# Altium schematic sheet LIDO-HW.300.DisplayInterface.SchDoc
size A3; SheetNumber: 15; SheetTotal: 17
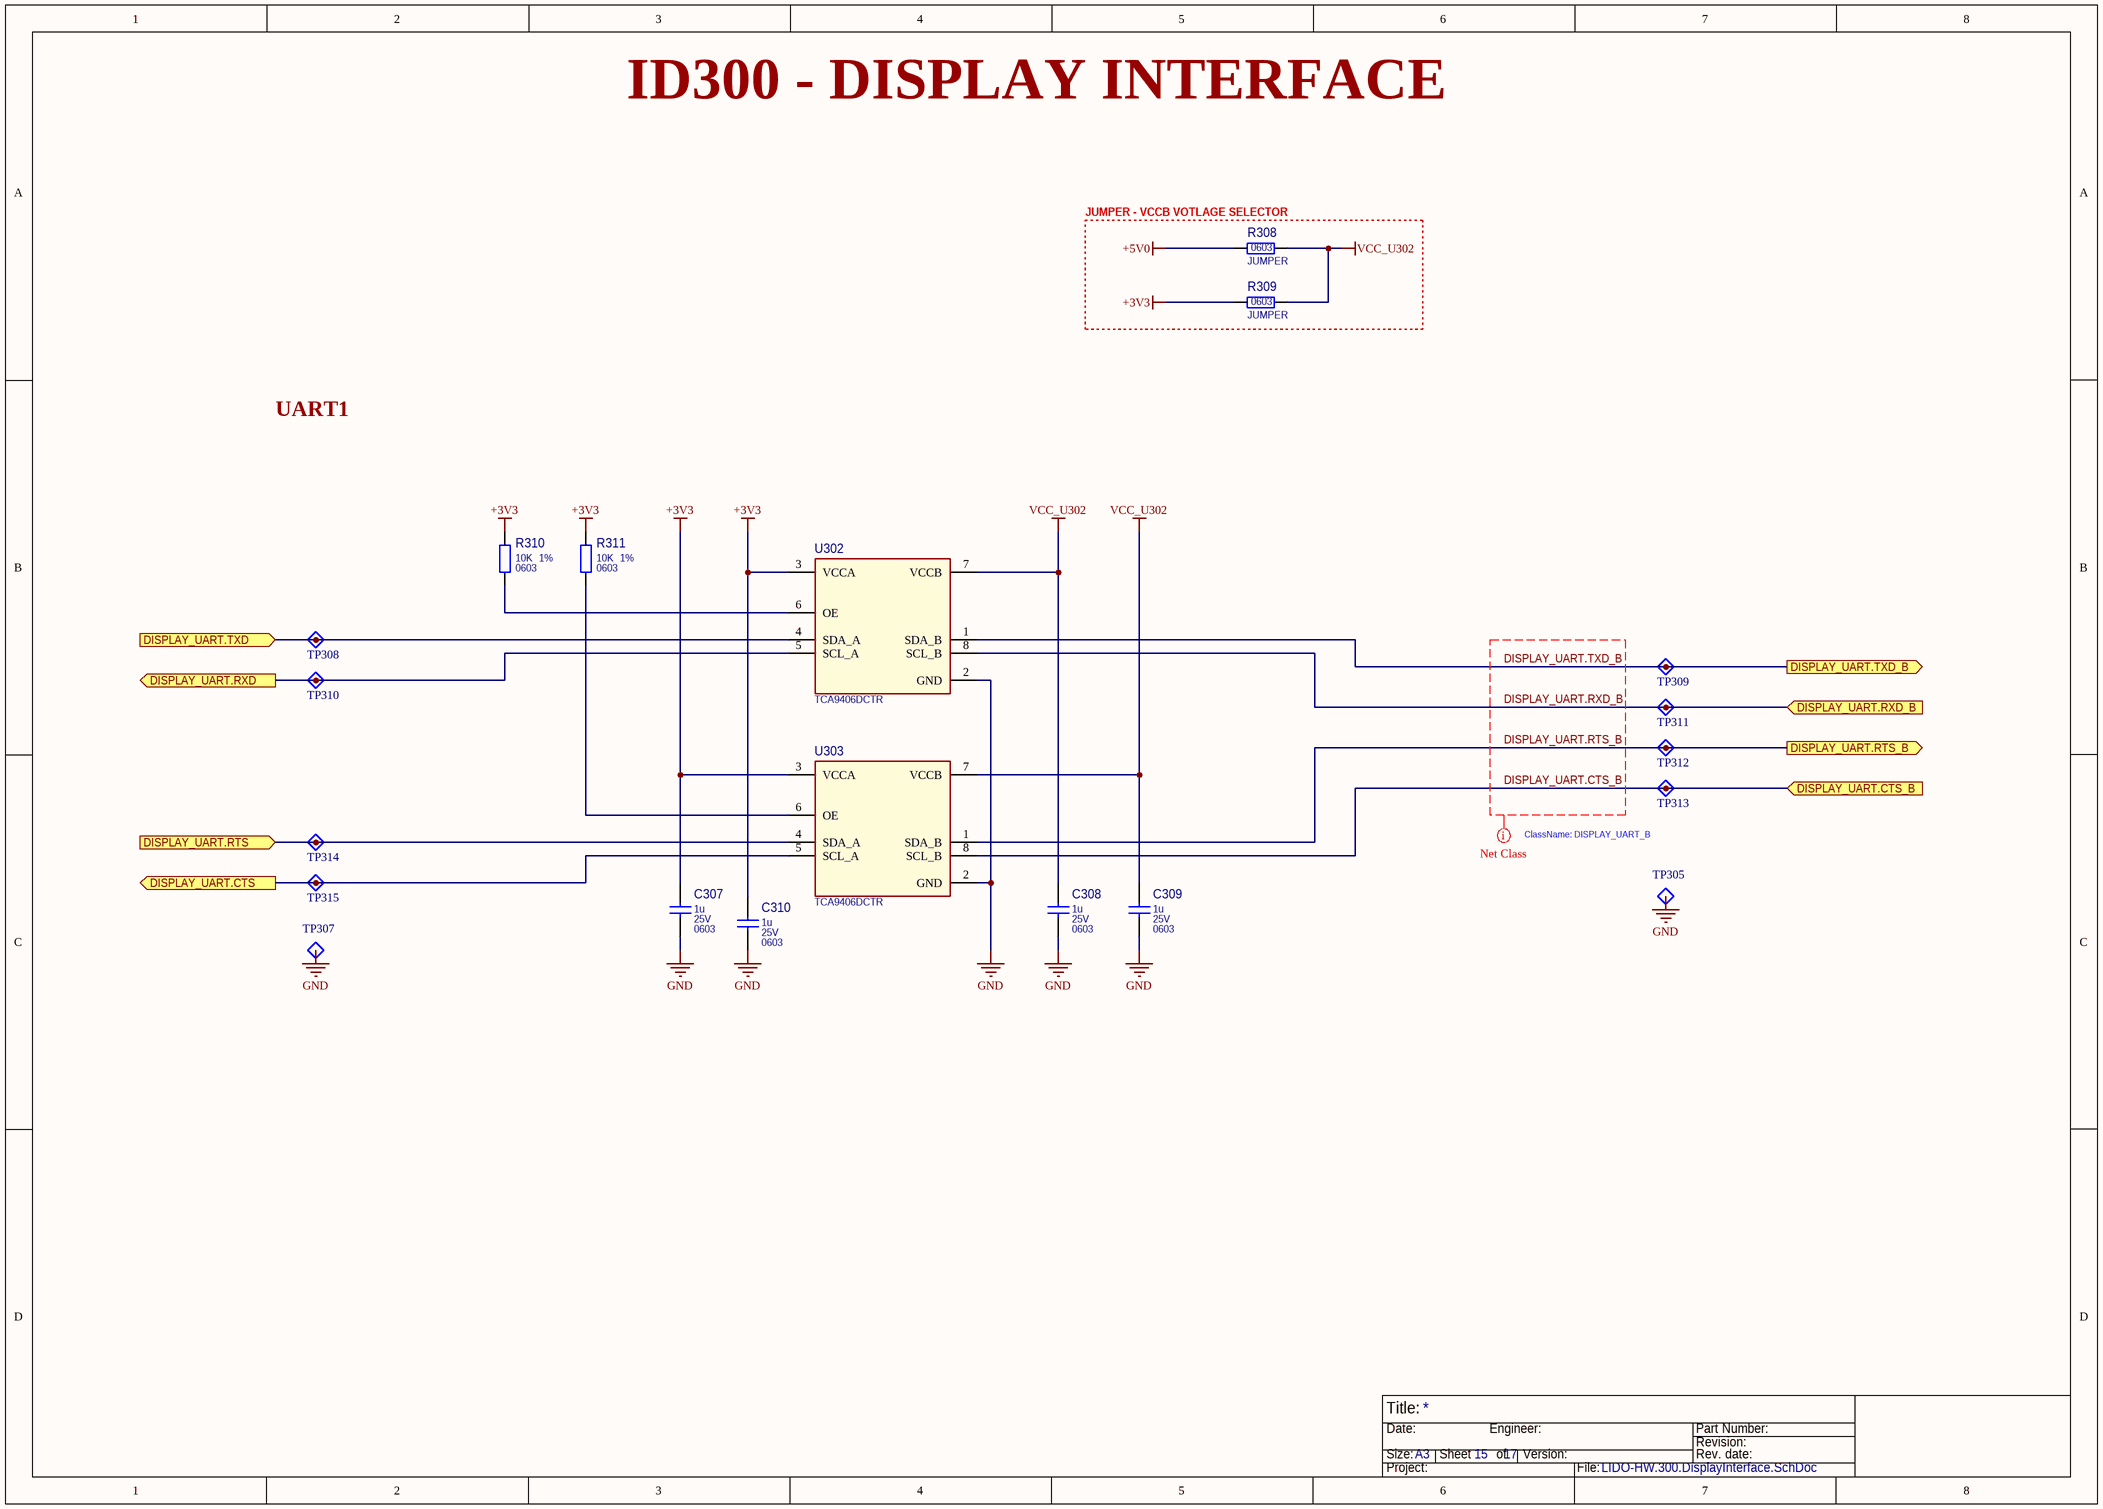
[diagram p0: LIDO-HW.300.DisplayInterface.SchDoc]

## Parts
C307  1u  Part Value 2: 25V  Part Package: 0603  [CAP_0603_1608X90-N_MURATA_A]
C308  1u  Part Value 2: 25V  Part Package: 0603  [CAP_0603_1608X90-N_MURATA_A]
C309  1u  Part Value 2: 25V  Part Package: 0603  [CAP_0603_1608X90-N_MURATA_A]
C310  1u  Part Value 2: 25V  Part Package: 0603  [CAP_0603_1608X90-N_MURATA_A]
R308  JUMPER  Part Package: 0603  [RES_0603_1608X60-N_YAGEO_A]
R309  JUMPER  Part Package: 0603  [RES_0603_1608X60-N_YAGEO_A]
R310  10K  Part Value 2: 1%  Part Package: 0603  [RES_0603_1608X60-N_YAGEO_A]
R311  10K  Part Value 2: 1%  Part Package: 0603  [RES_0603_1608X60-N_YAGEO_A]
TP305  TestPoint_A  [TESTPOINT_1D_A]  (value not drawn)  (no BOM)
TP307  TestPoint_A  [TESTPOINT_1D_A]  (value not drawn)  (no BOM)
TP308  TestPoint_A  [TESTPOINT_1D_A]  (value not drawn)  (no BOM)
TP309  TestPoint_A  [TESTPOINT_1D_A]  (value not drawn)  (no BOM)
TP310  TestPoint_A  [TESTPOINT_1D_A]  (value not drawn)  (no BOM)
TP311  TestPoint_A  [TESTPOINT_1D_A]  (value not drawn)  (no BOM)
TP312  TestPoint_A  [TESTPOINT_1D_A]  (value not drawn)  (no BOM)
TP313  TestPoint_A  [TESTPOINT_1D_A]  (value not drawn)  (no BOM)
TP314  TestPoint_A  [TESTPOINT_1D_A]  (value not drawn)  (no BOM)
TP315  TestPoint_A  [TESTPOINT_1D_A]  (value not drawn)  (no BOM)
U302  TCA9406DCTR  [SSOP8P65_295X400X130L40X25-N_TI_A]
U303  TCA9406DCTR  [SSOP8P65_295X400X130L40X25-N_TI_A]

## Blocks framed on the sheet
JUMPER - VCCB VOTLAGE SELECTOR: R308 R309

## Ports
DISPLAY_UART.CTS (out), DISPLAY_UART.CTS_B (in), DISPLAY_UART.RTS (in), DISPLAY_UART.RTS_B (out), DISPLAY_UART.RXD (out), DISPLAY_UART.RXD_B (in), DISPLAY_UART.TXD (in), DISPLAY_UART.TXD_B (out)

## Nets
+3V3: C307.1 C310.1 R309.1 R310.2 R311.2 U302.3(VCCA) U303.3(VCCA)
+5V0: R308.1
GND: C307.2 C308.2 C309.2 C310.2 TP305.1(TP) TP307.1(TP) U302.2(GND) U303.2(GND)
VCC_U302: C308.1 C309.1 R308.2 R309.2 U302.7(VCCB) U303.7(VCCB)
DISPLAY_UART.CTS: TP315.1(TP) U303.5(SCL_A) ; port DISPLAY_UART.CTS
DISPLAY_UART.CTS_B: TP313.1(TP) U303.8(SCL_B) ; port DISPLAY_UART.CTS_B
DISPLAY_UART.RTS: TP314.1(TP) U303.4(SDA_A) ; port DISPLAY_UART.RTS
DISPLAY_UART.RTS_B: TP312.1(TP) U303.1(SDA_B) ; port DISPLAY_UART.RTS_B
DISPLAY_UART.RXD: TP310.1(TP) U302.5(SCL_A) ; port DISPLAY_UART.RXD
DISPLAY_UART.RXD_B: TP311.1(TP) U302.8(SCL_B) ; port DISPLAY_UART.RXD_B
DISPLAY_UART.TXD: TP308.1(TP) U302.4(SDA_A) ; port DISPLAY_UART.TXD
DISPLAY_UART.TXD_B: TP309.1(TP) U302.1(SDA_B) ; port DISPLAY_UART.TXD_B
NetR310_1: R310.1 U302.6(OE)
NetR311_1: R311.1 U303.6(OE)

## Layout directives
net class DISPLAY_UART_B: DISPLAY_UART.CTS_B, DISPLAY_UART.RTS_B, DISPLAY_UART.RXD_B, DISPLAY_UART.TXD_B

## Notes on the sheet
- ID300 - DISPLAY INTERFACE
- UART1
- ClassName: DISPLAY_UART_B
- Title:
- Size:
- Date:
- A3
- Sheet       of
- Engineer:
- Version:
- Part Number:
- Revision:
- Rev. date:
- Project:
- File:

## Library data of the parts
C307-C310 = 78: CAP CER 1UF 25V X7R 0603; Manufacturer Part Number: CGA3E1X7R1E105M080AE; Manufacturer: TDK Corporation; Obsolete Part: False; Component ID: 78; Part Value: 1u; Part Value 3: X7R; Package Type: SMT
R308 R309 = 9: RES 0 OHM JUMPER 1/10W 0603; Manufacturer Part Number: RC0603JR-070RL; Manufacturer: YAGEO; Manufacturer Part Number 2nd: RMCF0603ZT0R00; Manufacturer 2nd: Stackpole Electronics Inc; Obsolete Part: False; Component ID: 9; Part Value: JUMPER; Part Value 2: 5%; Part Value 3: 1/10W; Package Type: SMT
R310 R311 = 115: RES 10K OHM 1% 1/10W 0603; Manufacturer Part Number: RC0603FR-0710KL; Manufacturer: YAGEO; Obsolete Part: False; Component ID: 115; Part Value: 10K; Part Value 3: 1/10W; Package Type: SMT
TP305 TP307-TP315 = 3: Pad Diamater 1mm; Part: Test Point 1D A; Obsolete Part: False; 00_Name: TP_XXmm; Component ID: 3; 02_Layer: *; 01_Diameter: 1mm
U302 U303 = 6: Voltage Level Translator Bidirectional 1 Circuit 2 Channel 24Mbps SM8; Manufacturer: Texas Instruments; Part Package: MSOP-8; Obsolete Part: False; Component ID: 6; Manufacturer Part Number: TCA9406DCTR; Part Type: Level Translator; Part Value: TCA9406DCTR; Package Type: SMT